# Altium project Proximo.PrjPCB
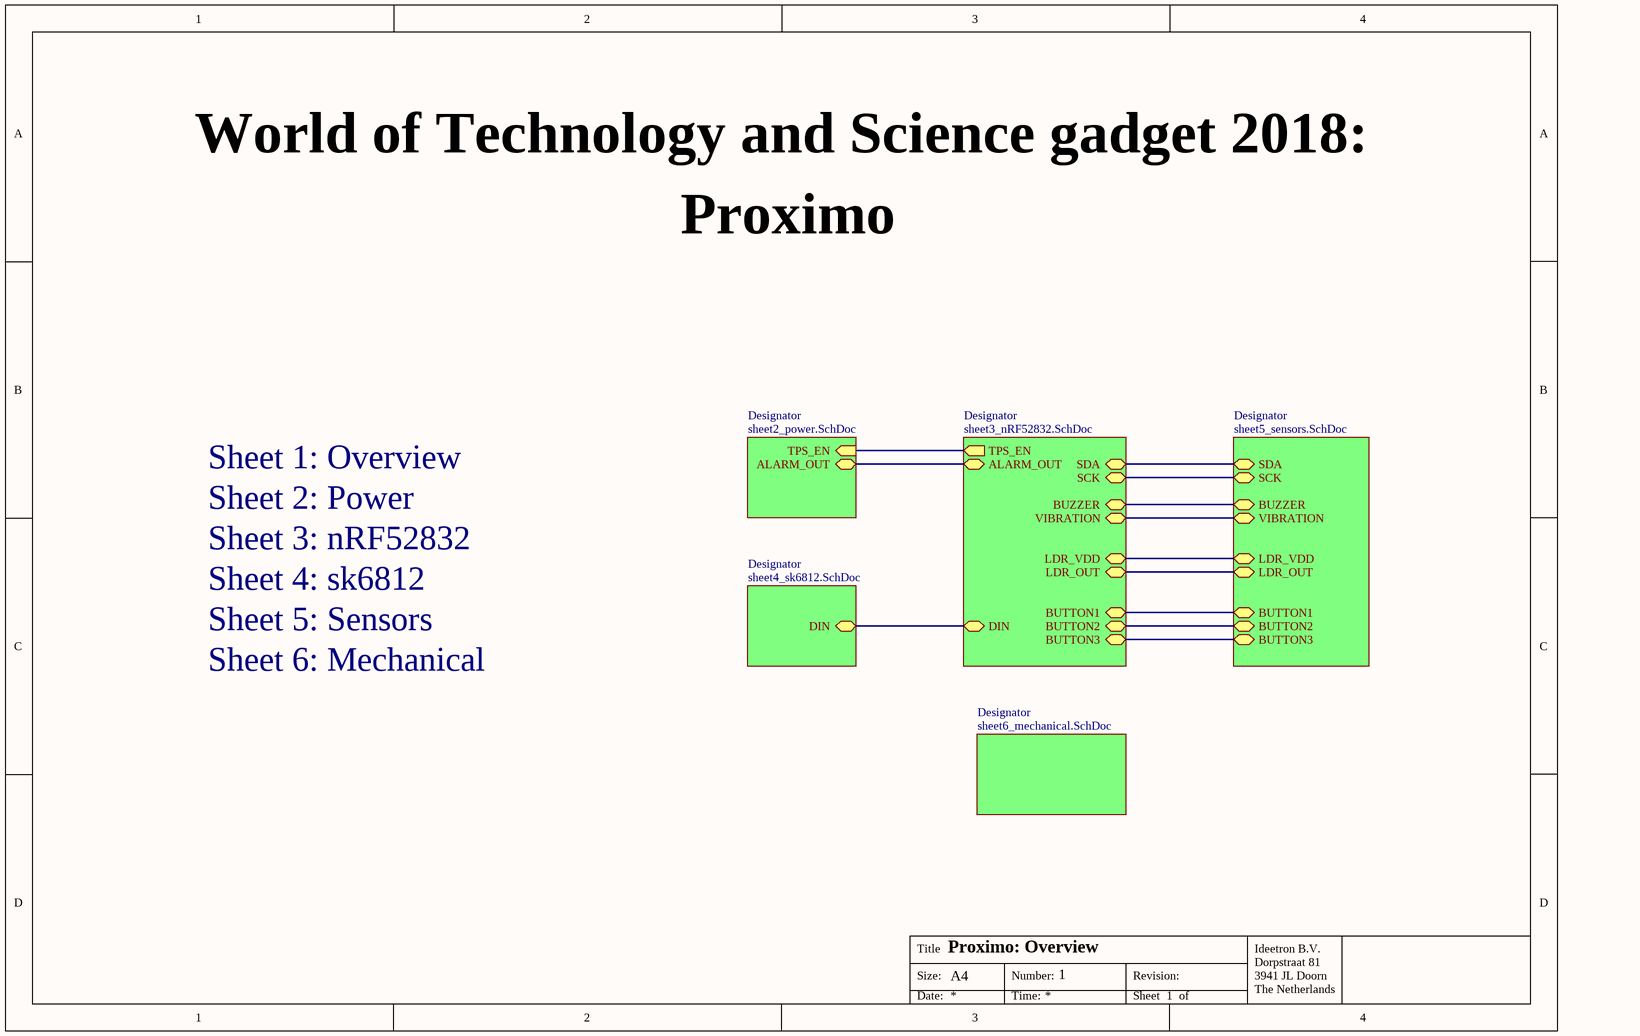
[diagram p0: sheet1_overview.SchDoc]
totalNbSheets: 6; ProjRevisionNumber: 0.9; projNumber: 1; ProjName: Proximo; EngineerName: A. Verhoef
6 sheets, 126 parts. Net scope: hierarchical (ports join the sheet entries above them; power ports are global).
Board file: PCB1.PcbDoc
Sheets:
  sheet1_overview.SchDoc
    Designator = sheet2_power.SchDoc
    Designator = sheet3_nRF52832.SchDoc
    Designator = sheet5_sensors.SchDoc
    Designator = sheet4_sk6812.SchDoc
    Designator = sheet6_mechanical.SchDoc

## Sheet sheet1_overview.SchDoc: Proximo: Overview
size A4; Engineer: A. Verhoef; Organization: Ideetron B.V.; Address1: Dorpstraat 81; Address2: 3941 JL Doorn; Address3: 3941 JL Doorn; Address4: The Netherlands; Revision: 0.9; SheetNumber: 1; SheetTotal: 6

### Sub-sheets
Designator = sheet2_power.SchDoc: ALARM_OUT (bidir), TPS_EN (in)
Designator = sheet3_nRF52832.SchDoc: TPS_EN (out), DIN (bidir), ALARM_OUT (bidir), BUZZER (bidir), VIBRATION (bidir), LDR_OUT (bidir), LDR_VDD (bidir), SDA (bidir), SCK (bidir), BUTTON3 (bidir), BUTTON2 (bidir), BUTTON1 (bidir)
Designator = sheet5_sensors.SchDoc: LDR_OUT (bidir), BUZZER (bidir), VIBRATION (bidir), SDA (bidir), LDR_VDD (bidir), BUTTON1 (bidir), BUTTON3 (bidir), SCK (bidir), BUTTON2 (bidir)
Designator = sheet4_sk6812.SchDoc: DIN (bidir)
Designator = sheet6_mechanical.SchDoc: no entries

### Nets
ALARM_OUT: sheet Designator/ALARM_OUT, sheet Designator/ALARM_OUT
BUTTON1: sheet Designator/BUTTON1, sheet Designator/BUTTON1
BUTTON2: sheet Designator/BUTTON2, sheet Designator/BUTTON2
BUTTON3: sheet Designator/BUTTON3, sheet Designator/BUTTON3
BUZZER: sheet Designator/BUZZER, sheet Designator/BUZZER
DIN: sheet Designator/DIN, sheet Designator/DIN
LDR_OUT: sheet Designator/LDR_OUT, sheet Designator/LDR_OUT
LDR_VDD: sheet Designator/LDR_VDD, sheet Designator/LDR_VDD
SCK: sheet Designator/SCK, sheet Designator/SCK
SDA: sheet Designator/SDA, sheet Designator/SDA
TPS_EN: sheet Designator/TPS_EN, sheet Designator/TPS_EN
VIBRATION: sheet Designator/VIBRATION, sheet Designator/VIBRATION

### Notes on the sheet
- World of Technology and Science gadget 2018:
- Proximo
- Sheet 1: Overview
- Sheet 2: Power
- Sheet 3: nRF52832
- Sheet 4: sk6812
- Sheet 5: Sensors
- Sheet 6: Mechanical
- Title
- Size:
- A4
- Number:
- Revision:
- Date:
- Time:
- Sheet
- of

## Sheet sheet2_power.SchDoc: Proximo: Power
size A4; Organization: Ideetron B.V.; Address1: Dorpstraat 81; Address2: 3941 JL Doorn; Address3: 3941 JL Doorn; Address4: The Netherlands; DocumentNumber: 1; Revision: 0.9; SheetNumber: 2; SheetTotal: 6
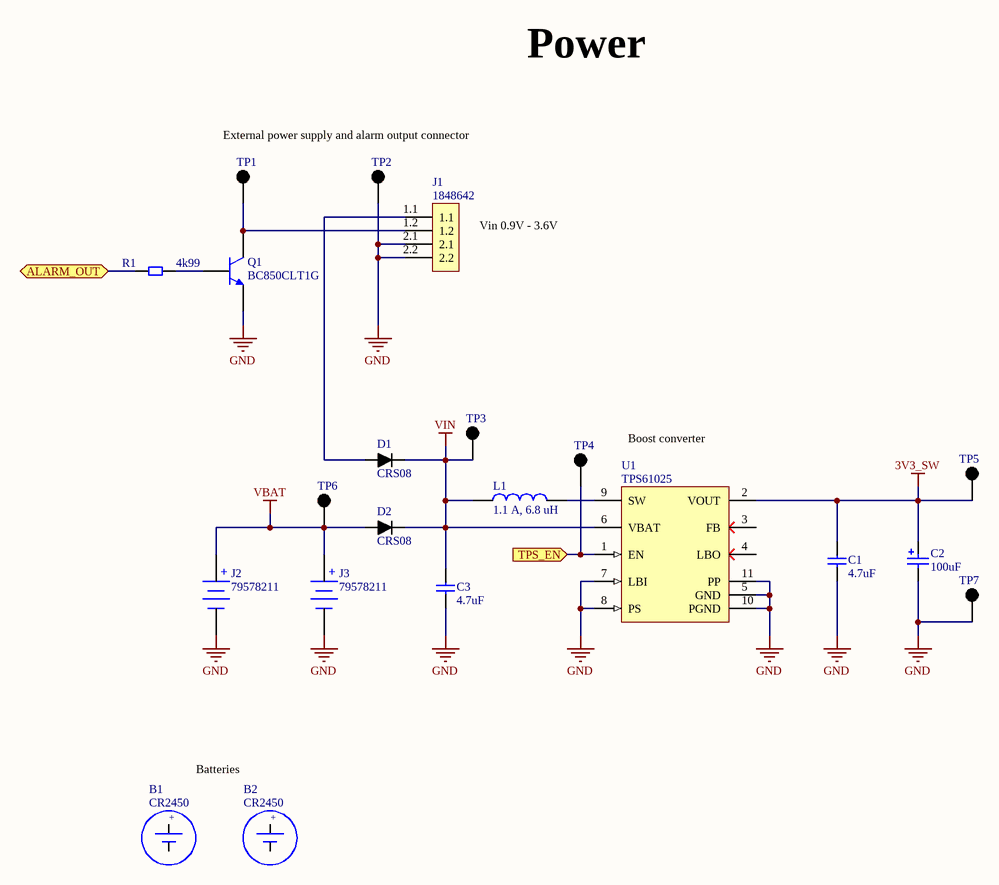
[diagram p1: sheet2_power.SchDoc]

### Parts
B1  CR2450
B2  CR2450
C1  4.7uF  [CAP0603_GR18_MURATA]
C2  100uF  [WCAP-PSHP_D10mm x L8.7mm]
C3  4.7uF  [CAP0603_GR18_MURATA]
D1  CRS08  [SOD-123F]
D2  CRS08  [SOD-123F]
J1  1848642  [Phoenix 1848642]
J2  79578211  [79578211]
J3  79578211  [79578211]
L1  1.1 A, 6.8 uH  [WE-MAPI_3015]
Q1  BC850CLT1G  [SOT23]
R1  4k99  [RES0603VISHAY]
TP1  testpad  [TestPad]  (value not drawn)  (no BOM)
TP2  testpad  [TestPad]  (value not drawn)  (no BOM)
TP3  testpad  [TestPad]  (value not drawn)  (no BOM)
TP4  testpad  [TestPad]  (value not drawn)  (no BOM)
TP5  testpad  [TestPad]  (value not drawn)  (no BOM)
TP6  testpad  [TestPad]  (value not drawn)  (no BOM)
TP7  testpad  [TestPad]  (value not drawn)  (no BOM)
U1  TPS61025  [DRC10-2400X1650TP]

### Ports
ALARM_OUT (bidir), TPS_EN (in)

### Nets
3V3_SW: C1.2 C2.1(P) TP5.1 U1.2(VOUT)
GND: C1.1 C2.2(N) C3.1 J1.2.1 J1.2.2 J2.2(Neg) J3.2(Neg) Q1.3 TP2.1 TP7.1 U1.5(GND) U1.7(LBI) U1.8(PS) U1.10(PGND) U1.11(PP)
VBAT: D2.A J2.1(Pos) J3.1(Pos) TP6.1
VIN: C3.2 D1.C D2.C L1.1 TP3.1 U1.6(VBAT)
ALARM_OUT: R1.1 ; port ALARM_OUT
TPS_EN: TP4.1 U1.1(EN) ; port TPS_EN
NetD1_A: D1.A J1.1.1
NetJ1_1.2: J1.1.2 Q1.1 TP1.1
NetL1_2: L1.2 U1.9(SW)
NetQ1_2: Q1.2 R1.2

Not connected (* = marked no-connect by the designer): U1 3(FB) 4(LBO)

### Notes on the sheet
- Power
- External power supply and alarm output connector
- (near J1) Vin 0.9V - 3.6V
- Boost converter
- (near B2) Batteries
- Title
- Size:
- A4
- Number:
- Revision:
- Date:
- Time:
- Sheet
- of
- (in symbol 79578211) +
- (in symbol Battery LCC 2450) +

### Library data of the parts
B1 B2 = Battery LCC 2450: CR2450 Coin cell battery; Manufacturer: Eve Energy; Remark: Coincell battery to be placed in the Battery holders J2 and J3; Sponsor: Elincom electronics; Value: CR2450; Package: CR2450
C1 C3 = CAP_0603_4u7: Capacitor X5R 0603 Murata; Manufacturer Part Number: GRM188R60J475KE19D; Sponsor: Nijkerk Electronics; Manufacturer: Murata; Pin Count: 2; Value: 4.7uF
C2 = 875115560004: WCAP-PSHP Aluminum Polymer Capacitors, D10mm x L8.7mm, 100 uF, 25 VDC; Manufacturer: Wurth Elektronik; Rated Voltage: 25 VDC; ComponentLink1Description: Manufacturer; ComponentLink1URL: http://www.we-online.de; ComponentLink2Description: Datasheet; ComponentLink2URL: http://katalog.we-online.de/pbs/datasheet/875115560004.pdf; Manufacturer Part Number: 875115560004; Published Date: Dec. 2017; Publisher: Wurth Elektronik; Size: D10mm x L8.7mm; Capacitance: 100 uF; Life Cycle: 2000 h; Operating Temperature: -55 to +105 degC; Sponsor: Wurth Elektronik; Value: 100uF
D1 D2 = CRS08 Schottky Diode: Manufacturer: Tohsiba; value: CRS08; Manufacturer Part Number: CRS08; Supplier 1: Mouser; Supplier Part Number 1: 757-CRS08(TE85R,Q,M)
J1 = Phoenix Connector: Plug component, Push-in spring connection; Manufacturer: Phoenix Contact; value: 1848642; Supplier 1: Digi-Key; Supplier 2: Mouser; Supplier Part Number 1: 277-12224-ND; Supplier Part Number 2: 651-1848642; Manufacturer Part Number: 1848642; Sponsor: Phoenix Contact
J2 J3 = 79578211: Battery Holder WA-BCPH, Battery Type: 2450p; BatteryType: 2450; Sponsor: Wurth Elektronik; PublishedDate: Nov. 2016; ComponentLink1Description: Manufacturer; ComponentLink1URL: http://www.we-online.de; ComponentLink2Description: Datasheet; ComponentLink2URL: http://katalog.we-online.de/em/datasheet/79578211.pdf; Publisher: Wurth Elektronik; value: 79578211; Manufacturer Part Number: 79578211; Manufacturer: Wurth Elektronik
L1 = 74438335068: WE-MAPI SMD Shielded Power Inductor, size 3015, 1.1 A, 6.8 uH; Manufacturer: Wurth Elektronik; Rated Current: 1.1 A; Inductance: 6.8 uH; DC Resistance max.: 287 mOhm; Value: 6.8 uH; ComponentLink1Description: Manufacturer; ComponentLink1URL: http://www.we-online.de; ComponentLink2Description: Datasheet; ComponentLink2URL: http://katalog.we-online.de/pbs/datasheet/74438335068.pdf; Published Date: Nov. 2017; Size: 3015; Operating Temperature: -40 to 125 degC; Manufacturer Part Number: 74438335068; Publisher: Wurth Elektronik; Sponsor: Wurth Elektronik
Q1 = BC850C: NPN general purpose transistor; Manufacturer: On Semiconductor; Manufacturer Part Number: NSVBC850CLT1G; value: BC850CLT1G; Supplier 1: Mouser; Supplier Part Number 1: 863-NSVBC850CLT1G; Sponsor: *
R1 = Resistor_4k99: SMD Resistor 4k99 0603; Manufacturer: Vishay; Manufacturer Part Number: CRCW06034K99FKTABC; Sponsor: MyProto - DVC; Value: 4k99; Supplier 1: *; Supplier Part Number 1: *; Remark: *
TP1-TP7 = TestPad: Signal probe pad; value: testpad
U1 = TPS61025DRCR: Boost Voltage Converter with 0.9 to 6.5 V Input, -40 to 85 degC, 10-Pin SON (DRC), Green (RoHS & no Sb/Br); Manufacturer: Texas Instruments; Preset Vout(V): 3.3; Regulated Outputs(#): 1; SubFamily: Step-Up Regulator; Switching Frequency(Max)(kHz): 720; Synchronous Rectification: TRUE; Vin(Max)(V): 6.5; Vin(Min)(V): 0.9; DatasheetVersion: SLVS451F; PackageVersion: revL, Sep-2011; PackageReference: DRC10-2400X1650TP; PackageDescription: 10-Pin Plastic Small Outline No-Lead, 3 x 3 x 1 mm Body, 0.5 mm Pitch, Exposed Pad; Supplier 1: Digi-Key; Supplier Part Number 1: 296-15844-2-ND; Supplier 2: Digi-Key; Supplier Part Number 2: 296-15844-1-ND; Supplier 3: Digi-Key; Supplier Part Number 3: 296-15844-6-ND; Supplier 4: Farnell; Supplier Part Number 4: 1703402; Supplier 5: Newark; Supplier Part Number 5: 87H2896; Supplier 6: Mouser; Supplier Part Number 6: 595-TPS61025DRCR; Eco-Plan: Green (RoHS & no Sb/Br); Topology: Boost; Mounting Technology: Surface Mount; ComponentLink1Description: Datasheet; ComponentLink1URL: http://www.ti.com/general/docs/lit/getliterature.tsp?genericPartNumber=TPS61025&fileType=pdf; ComponentLink2Description: Package Specification; ComponentLink2URL: http://www.ti.com/litv/pdf/mpds117k; value: TPS61025; Manufacturer Part Number: TPS61025DRCR

## Sheet sheet3_nRF52832.SchDoc: Proximo: nRF52832
size A4; Engineer: A. Verhoef; Organization: Ideetron B.V.; Address1: Dorpstraat 81; Address2: 3941 JL Doorn; Address3: 3941 JL Doorn; Address4: The Netherlands; Revision: 0.9; SheetNumber: 3; SheetTotal: 6
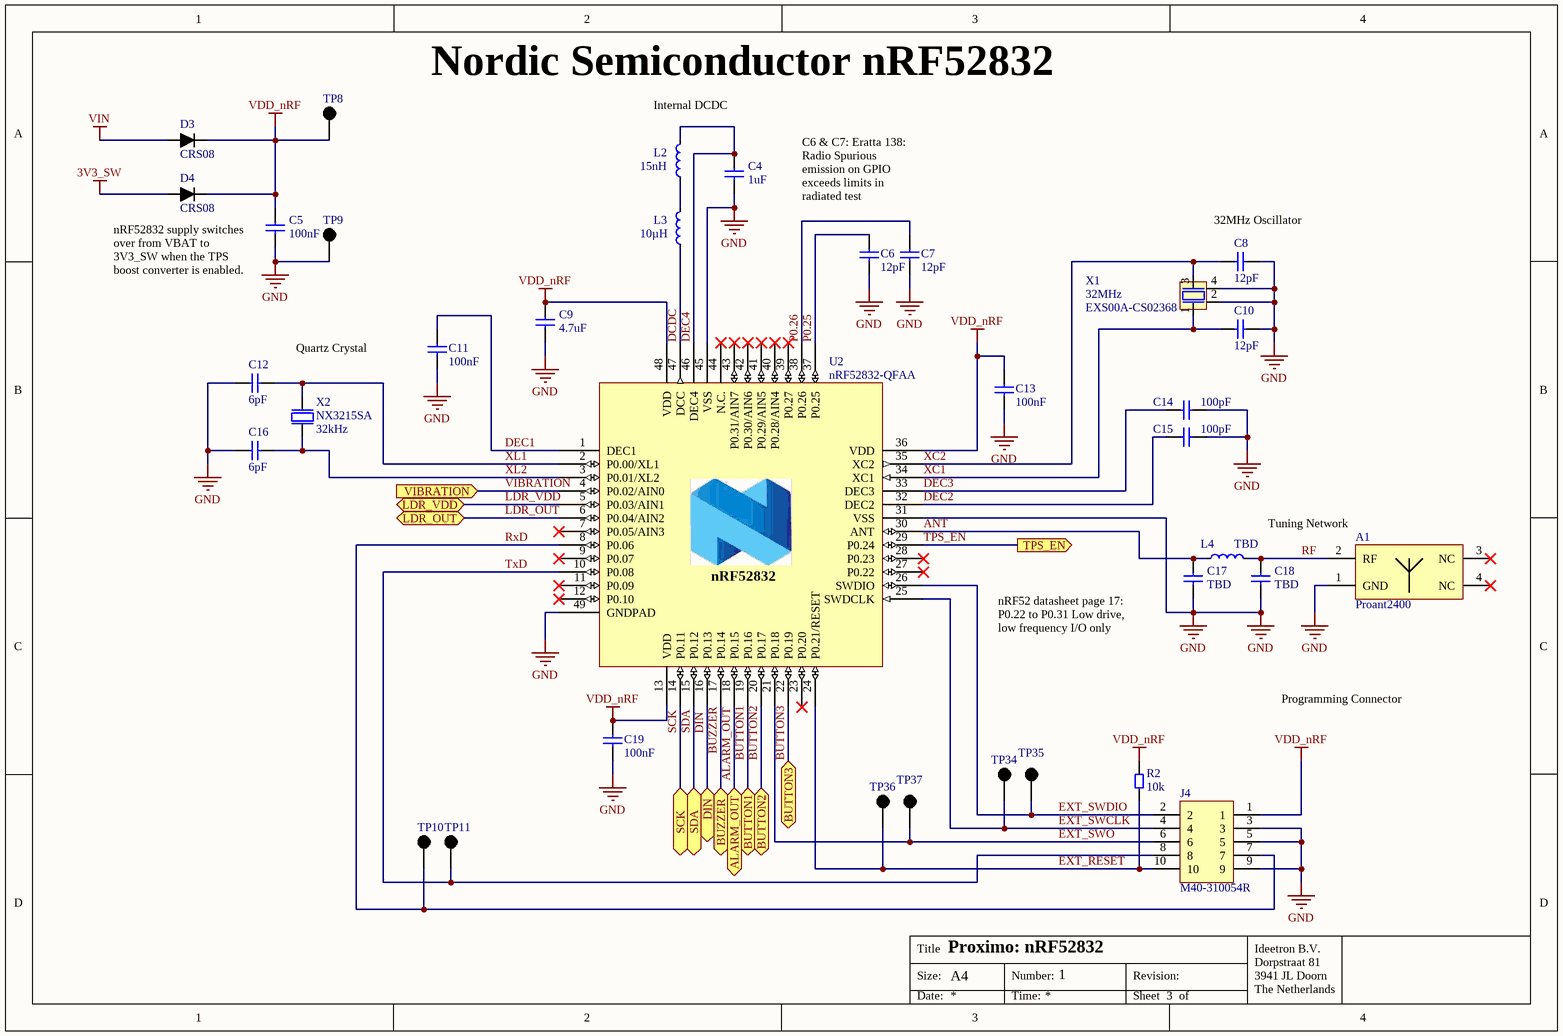
[diagram p2: sheet3_nRF52832.SchDoc]

### Parts
A1  Proant2400  [Proant2400]
C4  1uF  [CAP0603_GR18_MURATA]
C5  100nF  [CAP0603_GCx18_MURATA]
C6  12pF  [CAP0402_GCx15_Murata]
C7  12pF  [CAP0402_GCx15_Murata]
C8  12pF  [CAP0402_GCx15_Murata]
C9  4.7uF  [CAP0603_GR18_MURATA]
C10  12pF  [CAP0402_GCx15_Murata]
C11  100nF  [CAP0603_GCx18_MURATA]
C12  6pF  [CAP0603_GCx18_MURATA]
C13  100nF  [CAP0603_GCx18_MURATA]
C14  100pF  [CAP0603_GCx18_MURATA]
C15  100pF  [CAP0603_GCx18_MURATA]
C16  6pF  [CAP0603_GCx18_MURATA]
C17  TBD  [CAPC1005X04L]
C18  TBD  [CAPC1005X04L]
C19  100nF  [CAP0603_GCx18_MURATA]
D3  CRS08  [SOD-123F]
D4  CRS08  [SOD-123F]
J4  M40-310054R  [Harwin connector]
L2  15nH  [WE-MK_0402A]
L3  10µH  [74479777xxx_0805]
L4  TBD  [INDC1005X04L]
R2  10k  [RES0603VISHAY]
TP8  testpad  [TestPad]  (value not drawn)  (no BOM)
TP9  testpad  [TestPad]  (value not drawn)  (no BOM)
TP10  testpad  [TestPad]  (value not drawn)  (no BOM)
TP11  testpad  [TestPad]  (value not drawn)  (no BOM)
TP34  testpad  [TestPad]  (value not drawn)  (no BOM)
TP35  testpad  [TestPad]  (value not drawn)  (no BOM)
TP36  testpad  [TestPad]  (value not drawn)  (no BOM)
TP37  testpad  [TestPad]  (value not drawn)  (no BOM)
U2  nRF52832-QFAA  [QFN40P600X600X90-48N]
X1  EXS00A-CS02368  Frequency: 32MHz  [NDK-32MHz-XTAL]
X2  NX3215SA  Frequency: 32kHz  [XTAL_3215]

### Ports
ALARM_OUT (bidir), BUTTON1 (bidir), BUTTON2 (bidir), BUTTON3 (bidir), BUZZER (bidir), DIN (bidir), LDR_OUT (bidir), LDR_VDD (bidir), SCK (bidir), SDA (bidir), TPS_EN (out), VIBRATION (in)

### Nets
3V3_SW: D4.A
GND: A1.1(GND) C4.1 C5.1 C6.1 C7.1 C8.1 C9.1 C10.1 C11.1 C12.1 C13.1 C14.2 C15.2 C16.1 C17.1 C18.1 C19.1 J4.3 J4.5 J4.9 TP9.1 U2.31(VSS) U2.45(VSS) U2.49(GNDPAD) X1.2(GND) X1.4(GND)
VDD_nRF: C5.2 C9.2 C13.2 C19.2 D3.C D4.C J4.1 R2.2 TP8.1 U2.13(VDD) U2.36(VDD) U2.48(VDD)
VIN: D3.A
ALARM_OUT: U2.18(P0.15) ; port ALARM_OUT
ANT: C17.2 L4.1 U2.30(ANT)
BUTTON1: U2.19(P0.16) ; port BUTTON1
BUTTON2: U2.20(P0.17) ; port BUTTON2
BUTTON3: U2.22(P0.19) ; port BUTTON3
BUZZER: U2.17(P0.14) ; port BUZZER
DCDC: L3.1 U2.47(DCC)
DEC1: C11.2 U2.1(DEC1)
DEC2: C15.1 U2.32(DEC2)
DEC3: C14.1 U2.33(DEC3)
DEC4: C4.2 L2.2 U2.46(DEC4)
DIN: U2.16(P0.13) ; port DIN
EXT_RESET: J4.10 R2.1 TP36.1 U2.24(P0.21/RESET)
EXT_SWCLK: J4.4 TP34.1 U2.25(SWDCLK)
EXT_SWDIO: J4.2 TP35.1 U2.26(SWDIO)
EXT_SWO: J4.6 TP37.1 U2.21(P0.18)
LDR_OUT: U2.6(P0.04/AIN2) ; port LDR_OUT
LDR_VDD: U2.5(P0.03/AIN1) ; port LDR_VDD
P0.25: C6.2 U2.37(P0.25)
P0.26: C7.2 U2.38(P0.26)
RF: A1.2(RF) C18.2 L4.2
RxD: J4.7 TP10.1 U2.8(P0.06)
SCK: U2.14(P0.11) ; port SCK
SDA: U2.15(P0.12) ; port SDA
TPS_EN: U2.29(P0.24) ; port TPS_EN
TxD: J4.8 TP11.1 U2.10(P0.08)
VIBRATION: U2.4(P0.02/AIN0) ; port VIBRATION
XC1: C10.2 U2.34(XC1) X1.1(inp)
XC2: C8.2 U2.35(XC2) X1.3(out)
XL1: C12.2 U2.2(P0.00/XL1) X2.2(out)
XL2: C16.2 U2.3(P0.01/XL2) X2.1(inp)
NetL2_1: L2.1 L3.2

Not connected (* = marked no-connect by the designer): A1 3(NC)* 4(NC)*; U2 7(P0.05/AIN3)* 9(P0.07)* 11(P0.09)* 12(P0.10)* 23(P0.20)* 27(P0.22)* 28(P0.23)* 39(P0.27)* 40(P0.28/AIN4)* 41(P0.29/AIN5)* 42(P0.30/AIN6)* 43(P0.31/AIN7)* 44(N.C.)*

### Notes on the sheet
- Nordic Semiconductor nRF52832
- (near L2) Internal DCDC
- C6 & C7: Eratta 138: Radio Spurious emission on GPIO exceeds limits in radiated test
- 32MHz Oscillator
- nRF52832 supply switches over from VBAT to 3V3_SW when the TPS boost converter is enabled.
- Quartz Crystal
- Tuning Network
- nRF52 datasheet page 17:
  P0.22 to P0.31 Low drive, low frequency I/O only
- Programming Connector
- Title
- Size:
- A4
- Number:
- Revision:
- Date:
- Time:
- Sheet
- of
- (in symbol nRF52832_QFAA) nRF52832

### Library data of the parts
A1 = Proant2400: Onboard SMD 2400 MHz Antenna for BLE, WLAN/Wifi; Manufacturer: Proant; Manufacturer Part Number: PRO-OB-440; Sponsor: TOP-electronics; value: Proant2400; Supplier 1: Digi-Key; Supplier 2: Digi-Key; Supplier Part Number 1: 1532-1001-6-ND; Supplier Part Number 2: 1532-1001-2-ND
C4 = CAP_0603_1uF: Capacitor 1uF X5R 0603 Murata; Manufacturer Part Number: GRM188R61E105KA12D; Sponsor: Nijkerk Electronics; Manufacturer: Murata; Pin Count: 2; Value: 1uF
C5 C11 C13 C19 = CAP_0603_100nF: Capacitor 0603 100nF; Manufacturer: Murata; Manufacturer Part Number: GCJ188R71C104KA01D; Sponsor: Nijkerk Electronics; Pin Count: 2; Value: 100nF
C6-C8 C10 = CAP_0402_12pF: Capacitor NP0 0402; Manufacturer: Murata; Manufacturer Part Number: GCM1555C1H120JA16D; Sponsor: Nijkerk Electronics; Pin Count: 2; Value: 12pF
C9 = CAP_0603_4u7: as C1 on sheet sheet2_power; Manufacturer: Murata; Pin Count: 2; Value: 4.7uF
C12 C16 = CAP_0603_6pF: Capacitor NP0 0603 50V; Part Number: GCM1885C1H6R0CA16D; Manufacturer: Murata; Sponsor: Nijkerk Electronics; Manufacturer Part Number: GCM1885C1H6R0CA16D; Pin Count: 2; Value: 6pF
C14 C15 = CAP_0603_100pF: Capacitor 100pF 0603 NP0; Manufacturer: Murata; Manufacturer Part Number: GCM1885C1H101JA16D; Sponsor: Nijkerk Electronics; Pin Count: 2; Value: 100pF
C17 C18 = CAP_0402: Capacitor, 0402; Sponsor: Nijkerk Electronics; Remark: Antenna tuning, To Be Determined; Manufacturer: *; Manufacturer Part Number: *; LatestRevisionDate: 2011-05-11; Pin Count: 2; Value: TBD; Supplier: *; Supplier part number: *; 2nd source Supplier: *; 2nd source part number: *; Footprint Doc: 0402
D3 D4 = CRS08 Schottky Diode: Manufacturer: Tohsiba; value: CRS08; Manufacturer Part Number: CRS08; Supplier 1: Mouser; Supplier Part Number 1: 757-CRS08(TE85R,Q,M)
J4 = Harwin Connector: Harwin connector 2Rows x 6 contacts M40-3100545R; Remark: DNP; value: M40-310054R; manufacturer: Harwin; Supplier 1: Mouser; Supplier Part Number 1: 855-M40-3100545R; Manufacturer Part Number: M40-310054R
L2 = WE-MK, 744784115A: WE-MK Multilayer Ceramic SMD Inductor, size 0402A, 15nH; Manufacturer: Wurth Elektronik; PublishedDate: Sep. 2016; Publisher: Wurth Elektronik; ComponentLink1Description: Manufacturer; ComponentLink1URL: http://www.we-online.de; ComponentLink2Description: Datasheet; ComponentLink2URL: http://katalog.we-online.de/pbs/datasheet/744784115A.pdf; PartNumber: 744784115A; Size: 0402A; Value: 15nH; Manufacturer Part Number: 744784115A
L3 = WE-PMI 0805, 74479777310A: WE-PMI Power Multilayer Inductor, L= 10.0µH; Manufacturer: Wurth Elektronik; partNo: 74479777310A; Inductance: 10.0µH; ComponentLink1Description: Manufacturer; ComponentLink1URL: http://www.we-online.de; Created by: Baojun Chen; Created Date: Dec.2015; ComponentLink2Description: Datasheet; ComponentLink2URL: http://katalog.we-online.de/pbs/datasheet/74479777310A.pdf; Sponsor: Wurth Elektronik; Value: 10µH; Manufacturer Part Number: 74479777310A
L4 = IND_0402: High frequency chip inductor; 2nd source part number: 658-1328; Remark: Antenna tuning, To Be Determined; Pin Count: 2; Value: TBD; 2nd source Supplier: Farnell; Footprint Doc: 0402
R2 = Resistor_10k: SMD Resistor 10k 0603; Manufacturer: Vishay; Manufacturer Part Number: CRCW060310K0FKTABC; Sponsor: MyProto - DVC; Value: 10k; Supplier 1: *; Supplier Part Number 1: *; Remark: *
TP8-TP11 TP34-TP37 = TestPad: Signal probe pad; value: testpad
U2 = nRF52832_QFAA: Multi-protocol Bluetooth Low Energy, ANT and 2.4GHz proprietary system-on-chip; Manufacturer: Nordic Semiconductor; Part Number: nRF52832-QFAA; Manufacturer Part Number: nRF52832-QFAA; Pin Count: 48; Value: nRF52832-QFAA; Supplier: Nordic Semiconductor; Supplier part number: nRF52832-QFAA; Footprint Doc: QFN-48; Remark: *; LatestRevisionDate: 2014-11-26; Publisher: Nordic Semiconductor; Published: 2014-11-26; Sponsor: Nordic Semiconductor
X1 = NDK_32MHZ_OCILLATOR: NDK  NX3225SA 32MHz Oscillator; Note: XTAL SMD 32.000MHz; Manufacturer: NDK; Manufacturer Part Number: NX3225SA; Pin Count: 4; Value: EXS00A-CS02368; Footprint Doc: XTAL_2016; Sponsor: NDK; Supplier 1: Digi-Key; Supplier Part Number 1: 644-1208-1-ND
X2 = NDK_32kHz: XTAL SMD 3215, 32.768kHz, Cl=9pF, Total Tol: ±50ppm; Part Number: XTAL_FC-135 32.768k; Manufacturer: NDK; Manufacturer Part Number: NX3215SA 32.768KHz EXS00A-MU00376; Note: XTAL SMD 32.768kHz, 3215; Pin Count: 2; Value: NX3215SA; Sponsor: NDK; Supplier 1: Digi-Key; Supplier Part Number 1: 644-1171-1-ND

## Sheet sheet5_sensors.SchDoc: Proximo: Sensors
size A4; Engineer: A. Verhoef; Organization: Ideetron B.V.; Address1: Dorpstraat 81; Address2: 3941 JL Doorn; Address3: 3941 JL Doorn; Address4: The Netherlands; Revision: 0.9; SheetNumber: 5; SheetTotal: 6
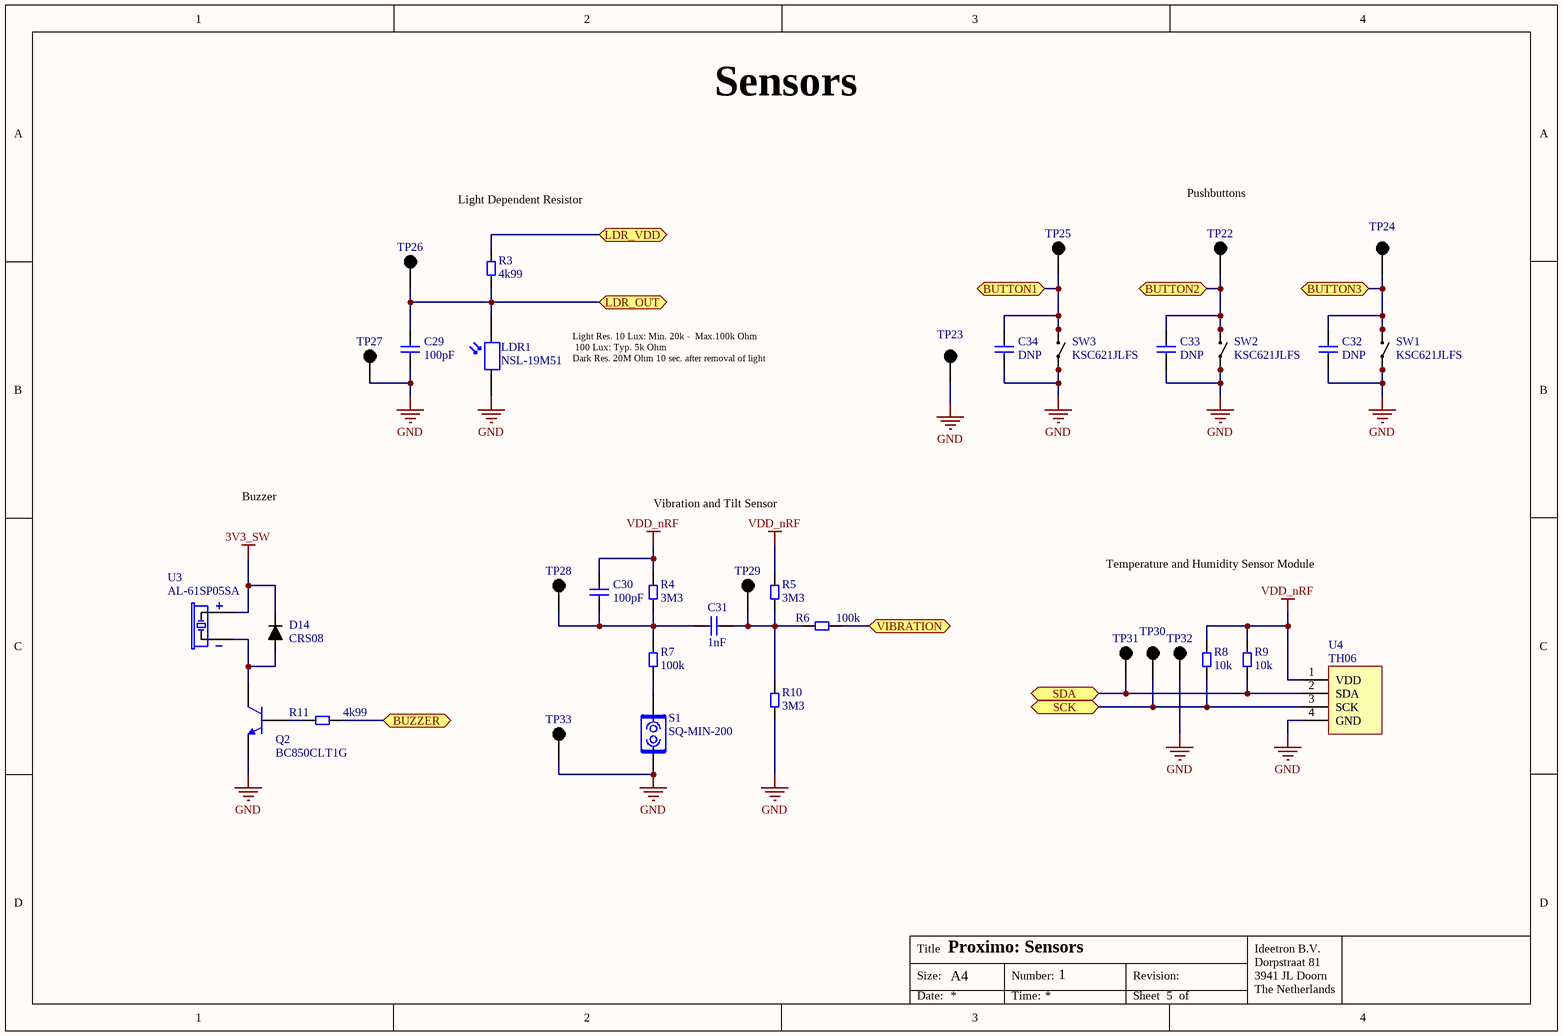
[diagram p3: sheet5_sensors.SchDoc]

### Parts
C29  100pF  [CAP0603_GCx18_MURATA]
C30  100pF  [CAP0603_GCx18_MURATA]
C31  1nF  [CAP0402_GCx18_Murata]
C32  Remark: DNP  [CAP0603_GCx18_MURATA]
C33  Remark: DNP  [CAP0603_GCx18_MURATA]
C34  Remark: DNP  [CAP0603_GCx18_MURATA]
D14  CRS08  [SOD-123F]
LDR1  NSL-19M51  [LDR]
Q2  BC850CLT1G  [SOT23]
R3  4k99  [RES0603VISHAY]
R4  3M3  [RES0603VISHAY]
R5  3M3  [RES0603VISHAY]
R6  100k  [RES0603VISHAY]
R7  100k  [RES0603VISHAY]
R8  10k  [RES0603VISHAY]
R9  10k  [RES0603VISHAY]
R10  3M3  [RES0603VISHAY]
R11  4k99  [RES0603VISHAY]
S1  SQ-MIN-200  [SQ-SEN-200]
SW1  KSC621JLFS  [KSC621JLFS]
SW2  KSC621JLFS  [KSC621JLFS]
SW3  KSC621JLFS  [KSC621JLFS]
TP22  testpad  [TestPad]  (value not drawn)  (no BOM)
TP23  testpad  [TestPad]  (value not drawn)  (no BOM)
TP24  testpad  [TestPad]  (value not drawn)  (no BOM)
TP25  testpad  [TestPad]  (value not drawn)  (no BOM)
TP26  testpad  [TestPad]  (value not drawn)  (no BOM)
TP27  testpad  [TestPad]  (value not drawn)  (no BOM)
TP28  testpad  [TestPad]  (value not drawn)  (no BOM)
TP29  testpad  [TestPad]  (value not drawn)  (no BOM)
TP30  testpad  [TestPad]  (value not drawn)  (no BOM)
TP31  testpad  [TestPad]  (value not drawn)  (no BOM)
TP32  testpad  [TestPad]  (value not drawn)  (no BOM)
TP33  testpad  [TestPad]  (value not drawn)  (no BOM)
U3  AL-61SP05SA  [Buzzer - AL-61SP05SA]
U4  TH06  [TH06_module]

### Ports
BUTTON1 (bidir), BUTTON2 (bidir), BUTTON3 (bidir), BUZZER (bidir), LDR_OUT (bidir), LDR_VDD (bidir), SCK (bidir), SDA (bidir), VIBRATION (bidir)

### Nets
3V3_SW: D14.C U3.2
GND: C29.1 C32.1 C33.1 C34.1 LDR1.1 Q2.3 R10.1 S1.1 SW1.3 SW1.4 SW2.3 SW2.4 SW3.3 SW3.4 TP23.1 TP27.1 TP32.1 TP33.1 U4.4(GND)
VDD_nRF: C30.2 R4.2 R5.2 R8.2 R9.2 U4.1(VDD)
BUTTON1: C34.2 SW3.1 SW3.2 TP25.1 ; port BUTTON1
BUTTON2: C33.2 SW2.1 SW2.2 TP22.1 ; port BUTTON2
BUTTON3: C32.2 SW1.1 SW1.2 TP24.1 ; port BUTTON3
BUZZER: R11.2 ; port BUZZER
LDR_OUT: C29.2 LDR1.2 R3.1 TP26.1 ; port LDR_OUT
LDR_VDD: R3.2 ; port LDR_VDD
SCK: R8.1 TP30.1 U4.3(SCK) ; port SCK
SDA: R9.1 TP31.1 U4.2(SDA) ; port SDA
VIBRATION: R6.1 ; port VIBRATION
NetC30_1: C30.1 C31.1 R4.1 R7.2 TP28.1
NetC31_2: C31.2 R5.1 R6.2 R10.2 TP29.1
NetD14_A: D14.A Q2.1 U3.1
NetQ2_2: Q2.2 R11.1
NetR7_1: R7.1 S1.2

### Notes on the sheet
- Sensors
- Light Dependent Resistor
- (near TP22) Pushbuttons
- Light Res. 10 Lux: Min. 20k -  Max.100k Ohm
  100 Lux: Typ. 5k Ohm
  Dark Res.	20M Ohm 10 sec. after removal of light
- Buzzer
- Vibration and Tilt Sensor
- Temperature and Humidity Sensor Module
- Title
- Size:
- A4
- Number:
- Revision:
- Date:
- Time:
- Sheet
- of

### Library data of the parts
C29 C30 = CAP_0603_100pF: as C14 on sheet sheet3_nRF52832; Pin Count: 2; Value: 100pF
C31 = CAP_0402_1nF: Capacitor 1nF 0402; Manufacturer: Murata; Manufacturer Part Number: GCM188R72A102KA37D; Sponsor: Nijkerk Electronics; Pin Count: 2; Value: 1nF
C32-C34 = CAP_0603_100pF: Capacitor 100pF 0603 NP0; Pin Count: 2
D14 = CRS08 Schottky Diode: Manufacturer: Tohsiba; value: CRS08; Manufacturer Part Number: CRS08; Supplier 1: Mouser; Supplier Part Number 1: 757-CRS08(TE85R,Q,M)
LDR1 = LDR: Light Dependant Resistor Phot; Manufacturer: Luna Optoelectronics; value: NSL-19M51; Supplier 1: Farnell; Supplier 2: Digi-Key; Supplier Part Number 1: 3168335; Supplier Part Number 2: NSL-19M51-ND; Sponsor: *; Manufacturer Part Number: NSL-19M51
Q2 = BC850C: as Q1 on sheet sheet2_power; value: BC850CLT1G; Supplier 1: Mouser; Supplier Part Number 1: 863-NSVBC850CLT1G; Sponsor: *
R3 R11 = Resistor_4k99: as R1 on sheet sheet2_power; Value: 4k99; Supplier 1: *; Supplier Part Number 1: *; Remark: *
R4 R5 R10 = Resistor_3M3: SMD Resistor 3M3 0603; Manufacturer: Vishay; Manufacturer Part Number: CRCW06033M30FKTABC; Sponsor: MyProto - DVC; Value: 3M3; Supplier 1: *; Supplier Part Number 1: *; Remark: *
R6 R7 = Resistor_100k: SMD Resistor 100k 0603; Manufacturer: Vishay; Manufacturer Part Number: CRCW0603100KFKTABC; Sponsor: MyProto - DVC; Value: 100k; Supplier 1: *; Supplier Part Number 1: *; Remark: *
R8 R9 = Resistor_10k: as R2 on sheet sheet3_nRF52832; Value: 10k; Supplier 1: *; Supplier Part Number 1: *; Remark: *
S1 = SQ-MIN-200: Nano Power Tilt and Vibration sensor; Manufacturer: SignalQuest; Sponsor: Ideetron; value: SQ-MIN-200; Manufacturer Part Number: SQ-MIN-200
SW1-SW3 = KSC621JLFS Tactile switch SMT: Tactile switch SMT; Manufacturer: C & K Components; Value: KSC621JLFS; Manufacturer Part Number: KSC621JLFS; Sponsor: *; Remark: *; Supplier 1: Farnell; Supplier Part Number 1: 2320054
TP22-TP33 = TestPad: Signal probe pad; value: testpad
U3 = PiezoBuzzer: Piezo Buzzer; Manufacturer: EKULIT; Sponsor: Elincom Electronics; Value: AL-61SP05SA; Manufacturer Part Number: AL-61SP05SA
U4 = TH06: I2C Humidity and Temperature Sensor module; Manufacturer: HopeRF; Sponsor: Ideetron; value: TH06; supplier: Ideetron; Manufacturer Part Number: TH06

## Sheet sheet4_sk6812.SchDoc: Proximo: SK6812
size A4; Organization: Ideetron B.V.; Address1: Dorpstraat 81; Address2: 3941 JL Doorn; Address3: 3941 JL Doorn; Address4: The Netherlands; Revision: 0.9; SheetNumber: 4; SheetTotal: 6; ProjectName: Proximo
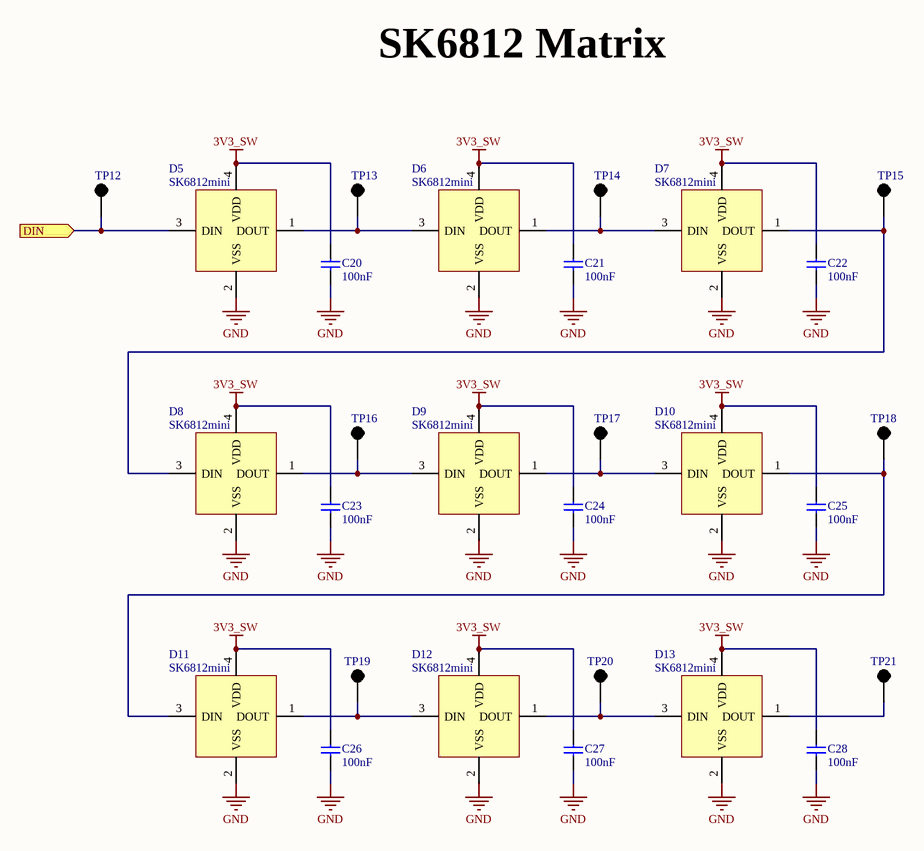
[diagram p4: sheet4_sk6812.SchDoc]

### Parts
C20  100nF  [CAP0603_GCx18_MURATA]
C21  100nF  [CAP0603_GCx18_MURATA]
C22  100nF  [CAP0603_GCx18_MURATA]
C23  100nF  [CAP0603_GCx18_MURATA]
C24  100nF  [CAP0603_GCx18_MURATA]
C25  100nF  [CAP0603_GCx18_MURATA]
C26  100nF  [CAP0603_GCx18_MURATA]
C27  100nF  [CAP0603_GCx18_MURATA]
C28  100nF  [CAP0603_GCx18_MURATA]
D5  SK6812mini  [SK6812mini]
D6  SK6812mini  [SK6812mini]
D7  SK6812mini  [SK6812mini]
D8  SK6812mini  [SK6812mini]
D9  SK6812mini  [SK6812mini]
D10  SK6812mini  [SK6812mini]
D11  SK6812mini  [SK6812mini]
D12  SK6812mini  [SK6812mini]
D13  SK6812mini  [SK6812mini]
TP12  testpad  [TestPad]  (value not drawn)  (no BOM)
TP13  testpad  [TestPad]  (value not drawn)  (no BOM)
TP14  testpad  [TestPad]  (value not drawn)  (no BOM)
TP15  testpad  [TestPad]  (value not drawn)  (no BOM)
TP16  testpad  [TestPad]  (value not drawn)  (no BOM)
TP17  testpad  [TestPad]  (value not drawn)  (no BOM)
TP18  testpad  [TestPad]  (value not drawn)  (no BOM)
TP19  testpad  [TestPad]  (value not drawn)  (no BOM)
TP20  testpad  [TestPad]  (value not drawn)  (no BOM)
TP21  testpad  [TestPad]  (value not drawn)  (no BOM)

### Ports
DIN (in)

### Nets
3V3_SW: C20.2 C21.2 C22.2 C23.2 C24.2 C25.2 C26.2 C27.2 C28.2 D5.4(VDD) D6.4(VDD) D7.4(VDD) D8.4(VDD) D9.4(VDD) D10.4(VDD) D11.4(VDD) D12.4(VDD) D13.4(VDD)
GND: C20.1 C21.1 C22.1 C23.1 C24.1 C25.1 C26.1 C27.1 C28.1 D5.2(VSS) D6.2(VSS) D7.2(VSS) D8.2(VSS) D9.2(VSS) D10.2(VSS) D11.2(VSS) D12.2(VSS) D13.2(VSS)
DIN: D5.3(DIN) TP12.1 ; port DIN
NetD5_1: D5.1(DOUT) D6.3(DIN) TP13.1
NetD6_1: D6.1(DOUT) D7.3(DIN) TP14.1
NetD7_1: D7.1(DOUT) D8.3(DIN) TP15.1
NetD8_1: D8.1(DOUT) D9.3(DIN) TP16.1
NetD9_1: D9.1(DOUT) D10.3(DIN) TP17.1
NetD10_1: D10.1(DOUT) D11.3(DIN) TP18.1
NetD11_1: D11.1(DOUT) D12.3(DIN) TP19.1
NetD12_1: D12.1(DOUT) D13.3(DIN) TP20.1
NetD13_1: D13.1(DOUT) TP21.1

### Notes on the sheet
- SK6812 Matrix
- Title
- Size:
- A4
- Number:
- Revision:
- Date:
- Time:
- Sheet
- of

### Library data of the parts
C20-C28 = CAP_0603_100nF: as C5 on sheet sheet3_nRF52832; Pin Count: 2; Value: 100nF
D5-D13 = SK6812: RGB LED with integrated controller; Manufacturer: Dongguang opsco optoelectronics CO. LTD; Sponsor: WoTS via Ideetron; value: SK6812mini; Manufacturer Part Number: *
TP12-TP21 = TestPad: Signal probe pad; value: testpad

## Sheet sheet6_mechanical.SchDoc: Proximo: Mechanical
size A4; Engineer: A. Verhoef; Organization: Ideetron B.V.; Address1: Dorpstraat 81; Address2: 3941 JL Doorn; Address3: 3941 JL Doorn; Address4: The Netherlands; Revision: 0.9; SheetNumber: 6; SheetTotal: 6
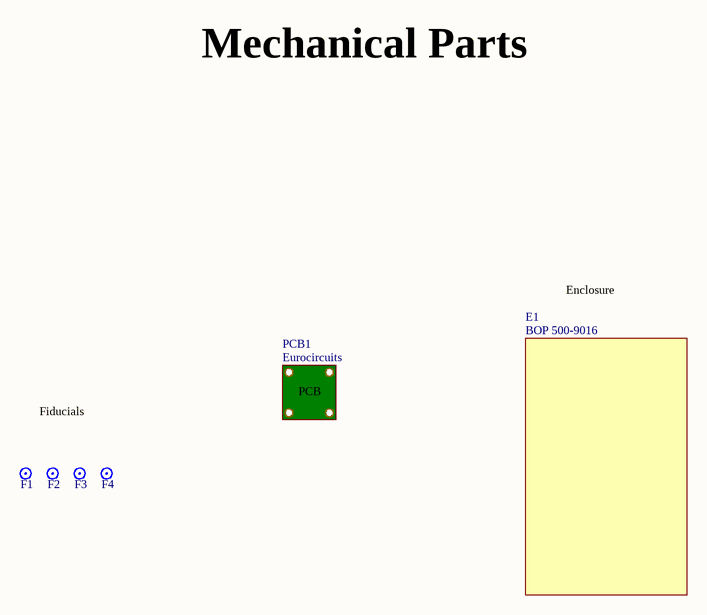
[diagram p5: sheet6_mechanical.SchDoc]

### Parts
E1  BOP 500-9016  (mechanical)
F1  Fiducial  [Fiducial]  (value not drawn)  (no BOM)
F2  Fiducial  [Fiducial]  (value not drawn)  (no BOM)
F3  Fiducial  [Fiducial]  (value not drawn)  (no BOM)
F4  Fiducial  [Fiducial]  (value not drawn)  (no BOM)
PCB1  PCB  (value not drawn)  (mechanical)

### Notes on the sheet
- Mechanical Parts
- Enclosure
- Fiducials
- Title
- Size:
- A4
- Number:
- Revision:
- Date:
- Time:
- Sheet
- of

### Library data of the parts
E1 = Bopla behuizing: Bopla ABS enclosure; Sponsor: PM Komponenten; Manufacturer: Bopla; Value: BOP 500-9016; Supplier 1: *; Supplier Part Number 1: *; Manufacturer Part Number: BOP 500-9016
PCB1 = PCB: Eurocircuits; Remark: Added for automatic inclusion in the BOM; Sponsor: Eurocircuits
F1-F4 = Fiducial: value: Fiducial

## Nets that join several sheets
3V3_SW: sheet2_power (C1.2 C2.1 TP5.1 U1.2), sheet3_nRF52832 (D4.A), sheet5_sensors (D14.C U3.2), sheet4_sk6812 (18 pins)
GND: sheet2_power (15 pins), sheet3_nRF52832 (26 pins), sheet5_sensors (19 pins), sheet4_sk6812 (18 pins)
VDD_nRF: sheet3_nRF52832 (12 pins), sheet5_sensors (6 pins)
VIN: sheet2_power (6 pins), sheet3_nRF52832 (D3.A)
ALARM_OUT: sheet2_power (R1.1), sheet3_nRF52832 (U2.18)
BUTTON1: sheet3_nRF52832 (U2.19), sheet5_sensors (C34.2 SW3.1 SW3.2 TP25.1)
BUTTON2: sheet3_nRF52832 (U2.20), sheet5_sensors (C33.2 SW2.1 SW2.2 TP22.1)
BUTTON3: sheet3_nRF52832 (U2.22), sheet5_sensors (C32.2 SW1.1 SW1.2 TP24.1)
BUZZER: sheet3_nRF52832 (U2.17), sheet5_sensors (R11.2)
DIN: sheet3_nRF52832 (U2.16), sheet4_sk6812 (D5.3 TP12.1)
LDR_OUT: sheet3_nRF52832 (U2.6), sheet5_sensors (C29.2 LDR1.2 R3.1 TP26.1)
LDR_VDD: sheet3_nRF52832 (U2.5), sheet5_sensors (R3.2)
SCK: sheet3_nRF52832 (U2.14), sheet5_sensors (R8.1 TP30.1 U4.3)
SDA: sheet3_nRF52832 (U2.15), sheet5_sensors (R9.1 TP31.1 U4.2)
TPS_EN: sheet2_power (TP4.1 U1.1), sheet3_nRF52832 (U2.29)
VIBRATION: sheet3_nRF52832 (U2.4), sheet5_sensors (R6.1)